# EAGLE design Lazerade_RGB (EAGLE 8.4.3)
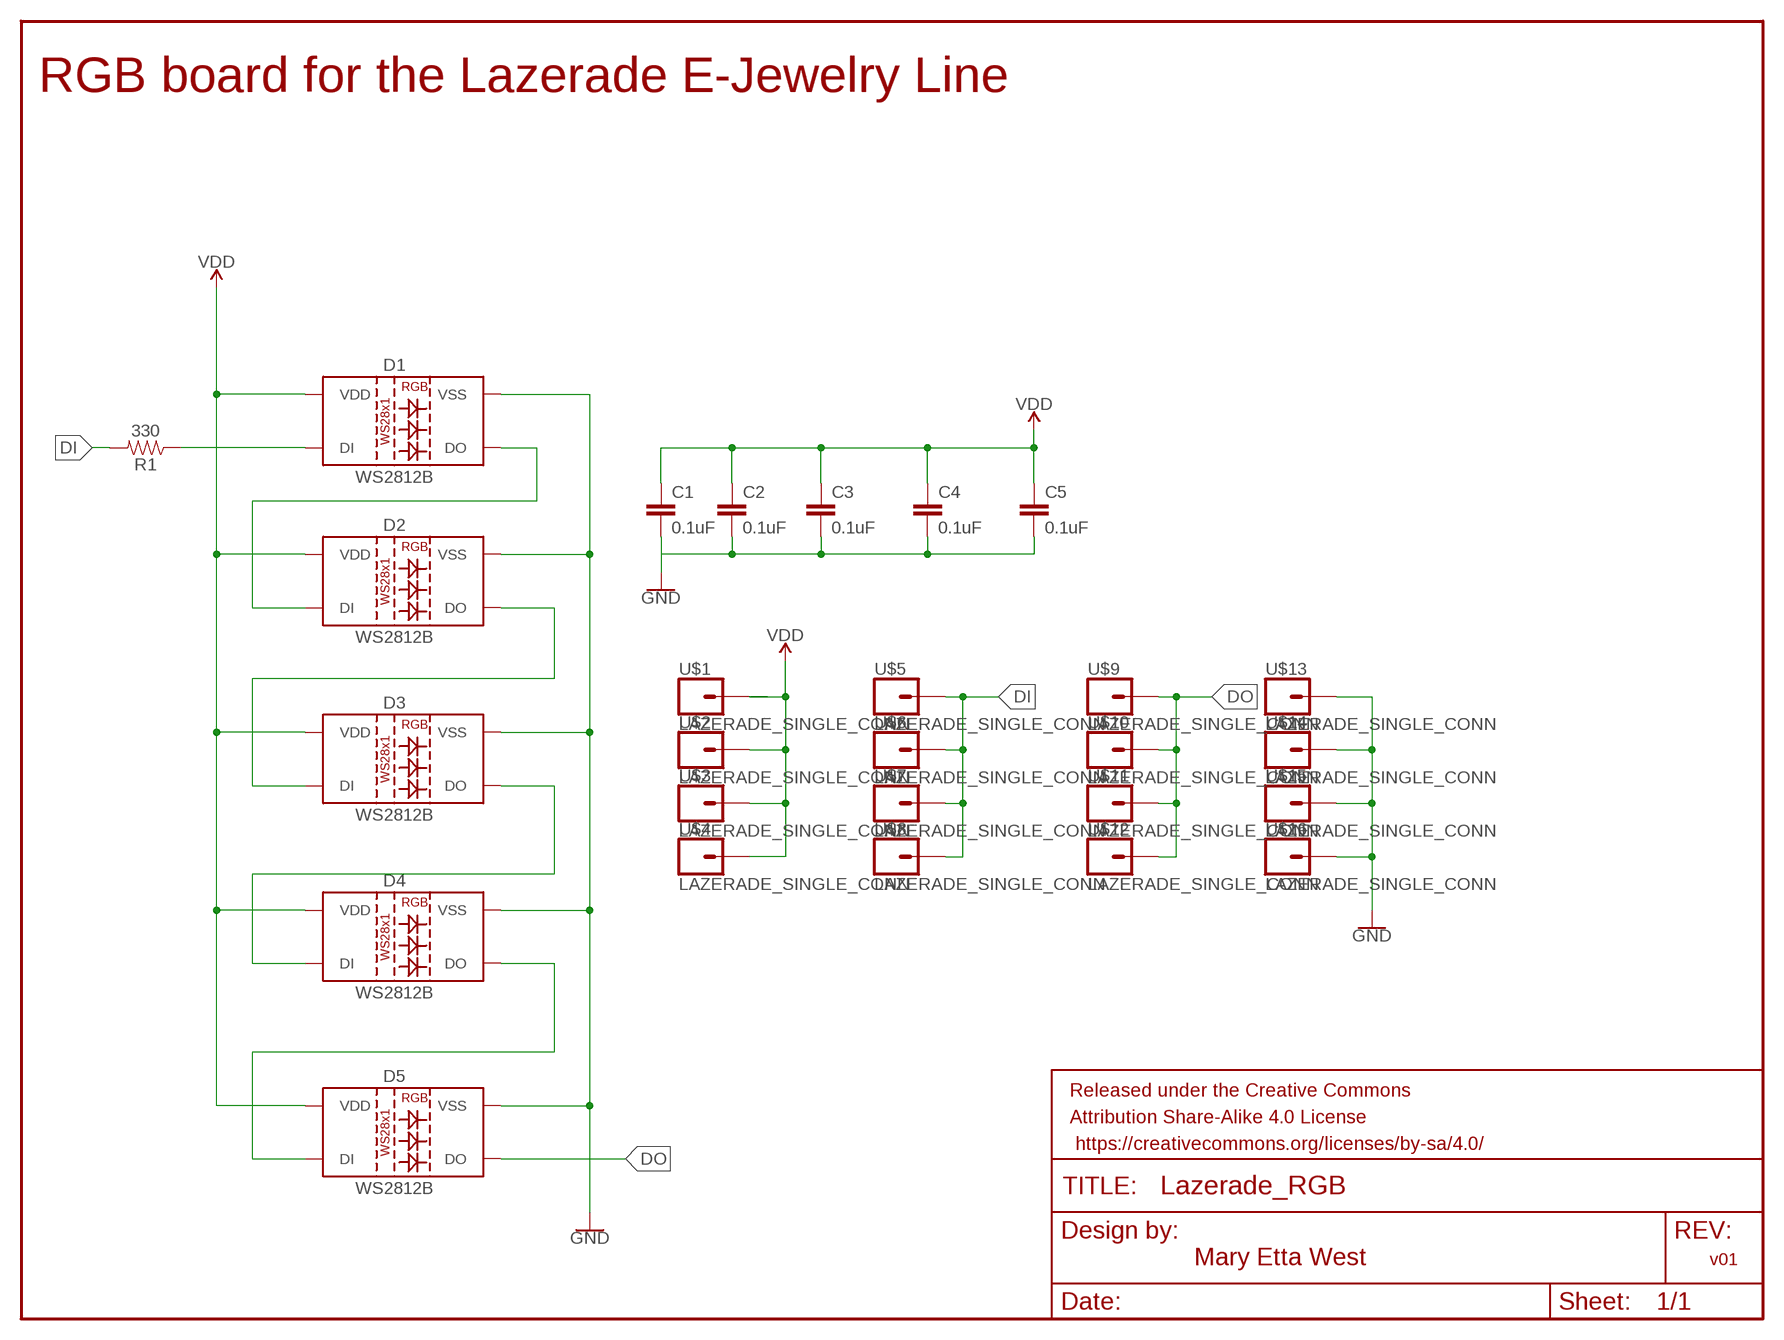
[diagram p0: schematic, sheet 1]

## Parts
C1  0.1uF  0.1UF-0603-25V-(+80/-20%)  [0603]
C2  0.1uF  0.1UF-0603-25V-(+80/-20%)  [0603]
C3  0.1uF  0.1UF-0603-25V-(+80/-20%)  [0603]
C4  0.1uF  0.1UF-0603-25V-(+80/-20%)  [0603]
C5  0.1uF  0.1UF-0603-25V-(+80/-20%)  [0603]
D1  WS2812B  [WS2812B]
D2  WS2812B  [WS2812B]
D3  WS2812B  [WS2812B]
D4  WS2812B  [WS2812B]
D5  WS2812B  [WS2812B]
FRAME1  FRAME-LETTER  [CREATIVE_COMMONS]
R1  330  330OHM-0603-1/10W-1%  [0603]
U$1  LAZERADE_SINGLE_CONN  [SINLGE_PAD_CONNECT]
U$2  LAZERADE_SINGLE_CONN  [SINLGE_PAD_CONNECT]
U$3  LAZERADE_SINGLE_CONN  [SINLGE_PAD_CONNECT]
U$4  LAZERADE_SINGLE_CONN  [SINLGE_PAD_CONNECT]
U$5  LAZERADE_SINGLE_CONN  [SINLGE_PAD_CONNECT]
U$6  LAZERADE_SINGLE_CONN  [SINLGE_PAD_CONNECT]
U$7  LAZERADE_SINGLE_CONN  [SINLGE_PAD_CONNECT]
U$8  LAZERADE_SINGLE_CONN  [SINLGE_PAD_CONNECT]
U$9  LAZERADE_SINGLE_CONN  [SINLGE_PAD_CONNECT]
U$10  LAZERADE_SINGLE_CONN  [SINLGE_PAD_CONNECT]
U$11  LAZERADE_SINGLE_CONN  [SINLGE_PAD_CONNECT]
U$12  LAZERADE_SINGLE_CONN  [SINLGE_PAD_CONNECT]
U$13  LAZERADE_SINGLE_CONN  [SINLGE_PAD_CONNECT]
U$14  LAZERADE_SINGLE_CONN  [SINLGE_PAD_CONNECT]
U$15  LAZERADE_SINGLE_CONN  [SINLGE_PAD_CONNECT]
U$16  LAZERADE_SINGLE_CONN  [SINLGE_PAD_CONNECT]

## Nets
DI: R1.2 U$5.P$1 U$6.P$1 U$7.P$1 U$8.P$1
DI_U: D1.4(DI) R1.1
DO: D5.2(DO) U$9.P$1 U$10.P$1 U$11.P$1 U$12.P$1
GND: C1.2 C2.2 C3.2 C4.2 C5.2 D1.3(VSS) D2.3(VSS) D3.3(VSS) D4.3(VSS) D5.3(VSS) U$13.P$1 U$14.P$1 U$15.P$1 U$16.P$1
N$3: D1.2(DO) D2.4(DI)
N$4: D2.2(DO) D3.4(DI)
N$5: D3.2(DO) D4.4(DI)
N$6: D4.2(DO) D5.4(DI)
VDD: C1.1 C2.1 C3.1 C4.1 C5.1 D1.1(VDD) D2.1(VDD) D3.1(VDD) D4.1(VDD) D5.1(VDD) U$1.P$1 U$2.P$1 U$3.P$1 U$4.P$1

## Notes on the sheet
- RGB board for the Lazerade E-Jewelry Line
- Mary Etta West | v01

## Library data of the parts
C1-C5 = SparkFun-Capacitors:0.1UF: 0.1µF ceramic capacitors A capacitor is a passive two-terminal electrical component used to store electrical energy temporarily in an electric field.; PROD_ID: CAP-00810
D1-D5 = SparkFun-LED:WS2812B: WS2812B SMD addressable RGB LED 5x5mm SMD LED with built-in controller IC. Color: Red/Green/Blue mC Rating: RGB: 390, 660, 180 mcd Forward Voltage: RGB: 2.0, 3.0, 3.0 V Packages:WS2812B SparkFun Products: Blynk Board - ESP8266 <https://www.sparkfun.com/products/13794>; PROD_ID: DIO-12503
FRAME1 = SparkFun-Aesthetics:FRAME-LETTER: Schematic Frame - Letter Standard 8.5x11 US Letter frame
R1 = SparkFun-Resistors:330OHM: 330Ω resistor A resistor is a passive two-terminal electrical component that implements electrical resistance as a circuit element. Resistors act to reduce current flow, and, at the same time, act to lower voltage levels within circuits. - Wikipedia; PROD_ID: RES-00818
U$1-U$16 = Lazerade_Connectors:LAZERADE_SINGLE_CONN

## Board
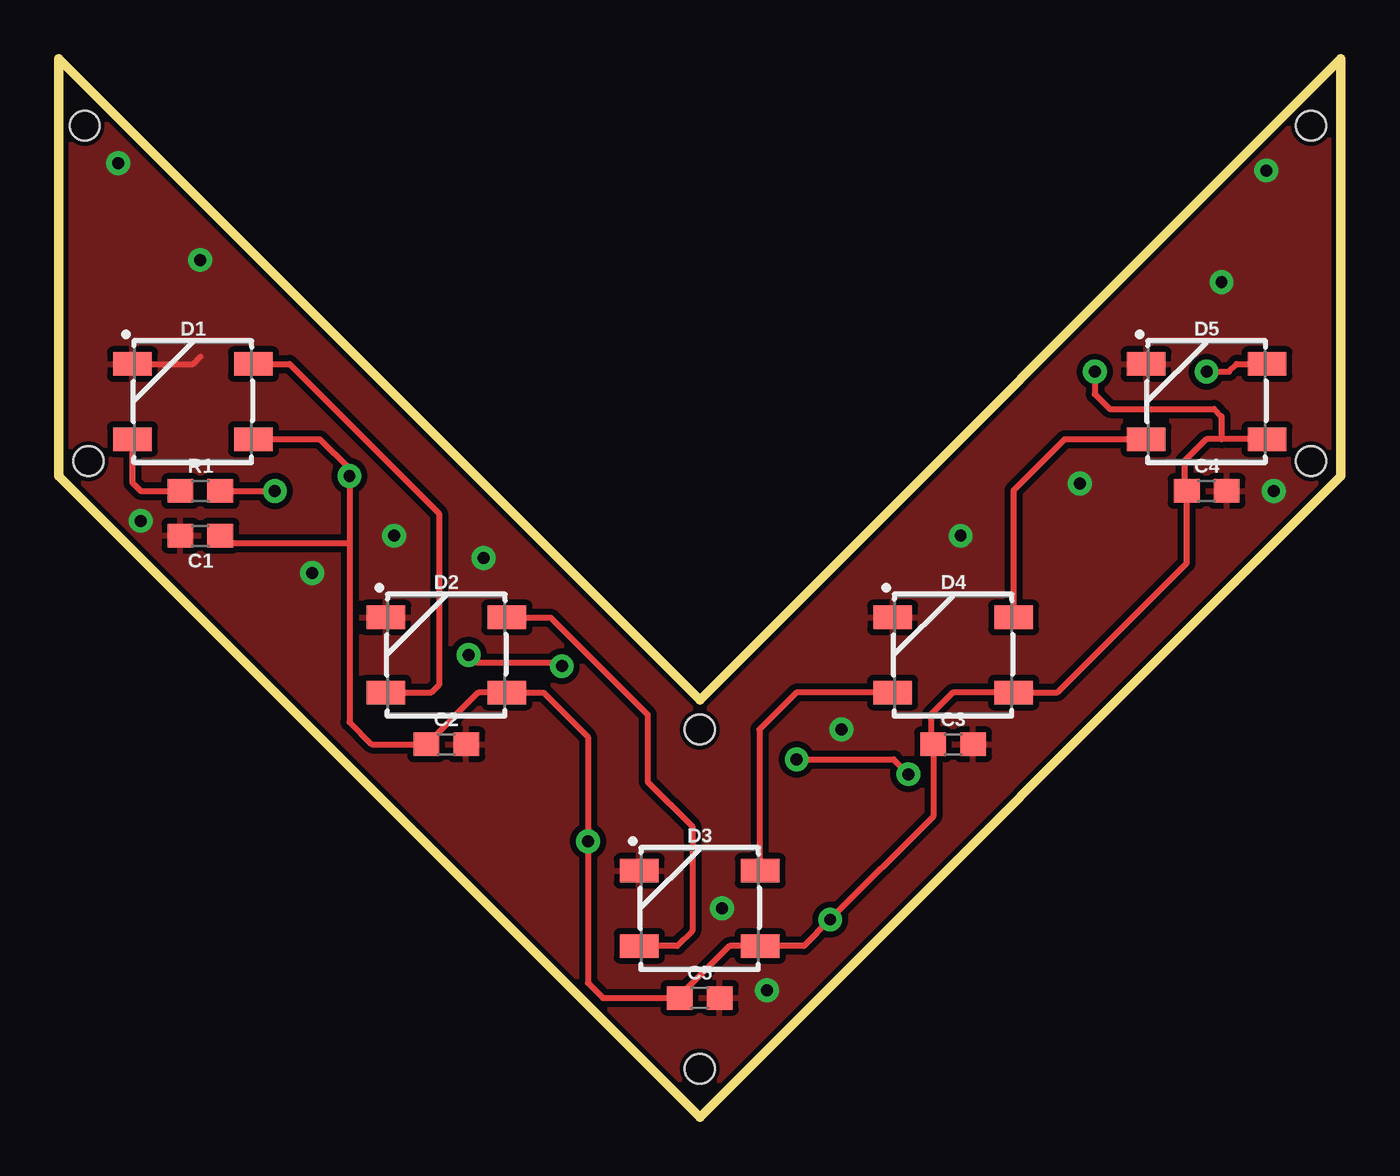
[diagram p1: board, top side]
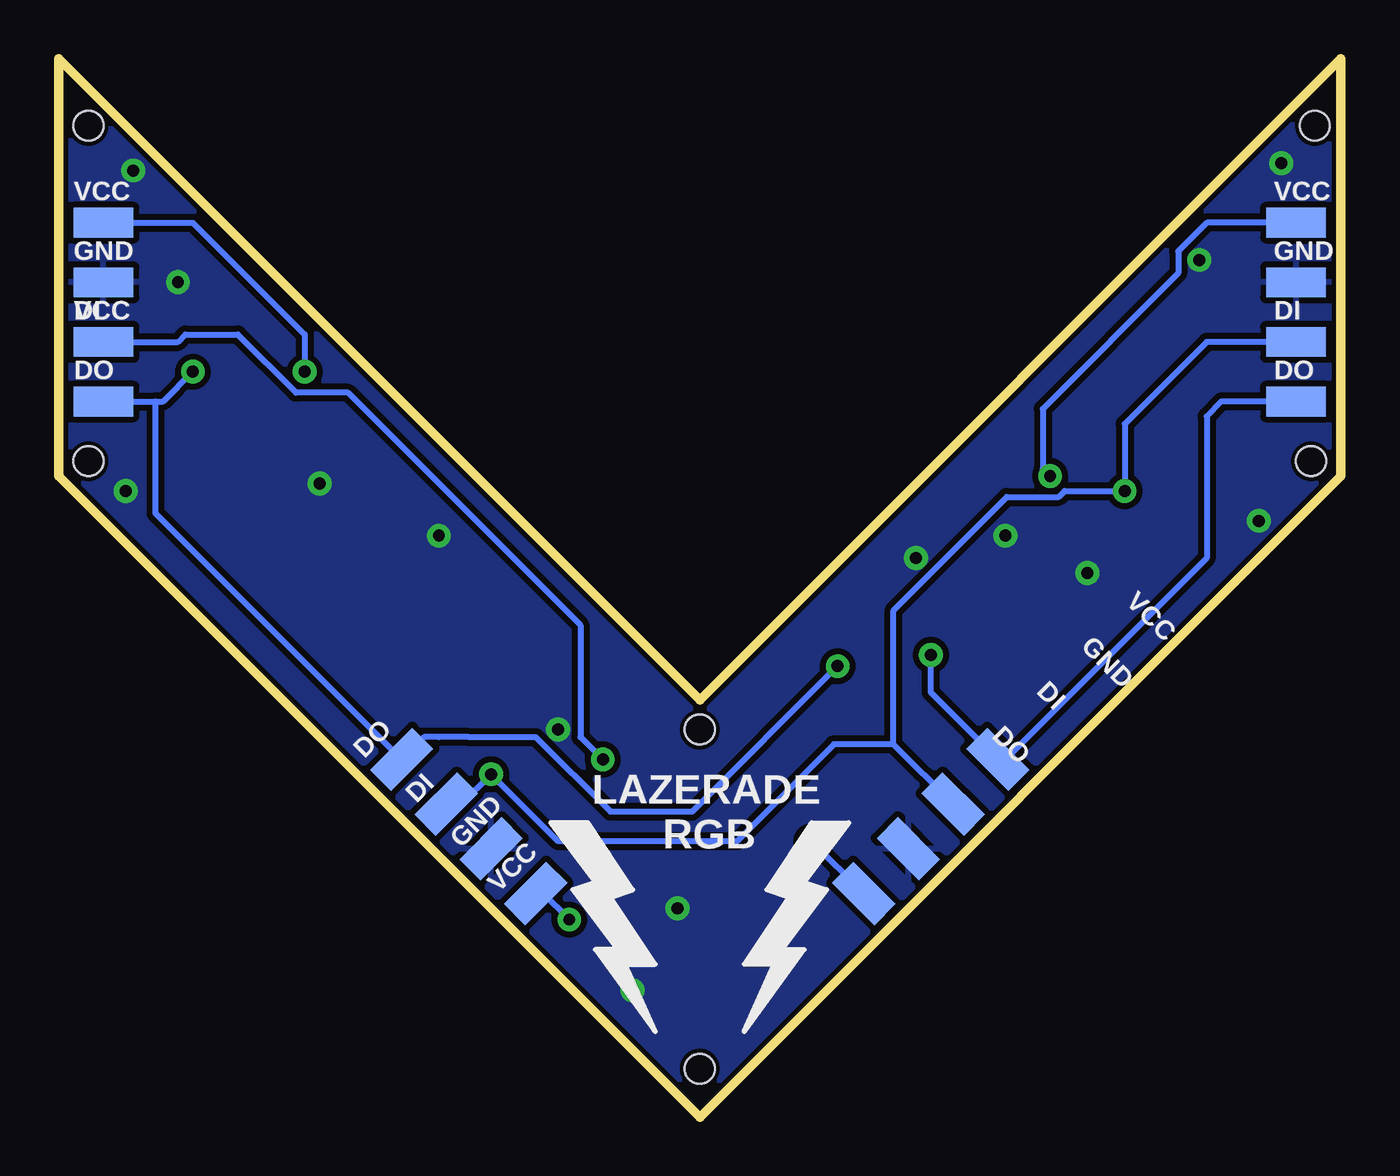
[diagram p2: board, bottom side, seen from below]

Size 54.61 x 45.09 mm. Coordinates in mm from the lower left corner, seen from the top.
Outline: 0,45.09 0,27.3 27.3,0 54.61,27.3 54.61,45.09 27.3,17.78 0,45.09
Copper layers (1*16): Top 0.035mm / dielectric 1.5mm / Bottom 0.035mm
Design rules "SparkFun-2-layer-STANDARD": minimum track width 10mil, minimum drill 20mil, track to track 10mil, track to pad 8mil, pad to pad 8mil, via to via 10mil, smd to smd 8mil, copper to edge 8mil, drill to drill 8mil, minimum pad ring 10mil, minimum via ring 10mil, stop-mask expansion 4mil, vias tented up to drill 25mil, thermal gap 10mil
Holes 1.27 mm at 1.11,42.23 1.27,27.94 53.34,27.94 53.34,42.23 27.3,2.06 27.3,16.51

### Footprints (pad centres in the part's own frame; a part is rotated, then mirrored left to right if it is on the bottom)
0603 = smd 1.1 x 1: 1 -0.85,0; 2 0.85,0
WS2812B = smd 1.651 x 1: 1 2.577,-1.6; 2 2.577,1.6; 3 -2.577,1.6; 4 -2.577,-1.6
SINLGE_PAD_CONNECT = smd 2.54 x 1.27: P$1 0,0

### Placement (x,y rotation side)
C1  6.03,24.77 180 top
C2  16.51,15.88 0 top
C3  38.1,15.88 0 top
C4  48.9,26.67 0 top
C5  27.3,5.08 0 top
D1  5.71,30.48 0 top
D2  16.51,19.68 0 top
D3  27.3,8.89 0 top
D4  38.1,19.68 0 top
D5  48.9,30.48 0 top
FRAME1  -3.17,-17.46 0 top  (outside the outline)
R1  6.03,26.67 0 top
U$1  52.7,38.1 0 bottom
U$2  20.32,9.53 315 bottom
U$3  34.29,9.53 45 bottom
U$4  1.91,38.1 0 bottom
U$5  1.91,33.02 0 bottom
U$6  52.7,33.02 0 bottom
U$7  38.1,13.34 45 bottom
U$8  16.51,13.34 315 bottom
U$9  1.91,30.48 0 bottom
U$10  14.6,15.24 315 bottom
U$11  40.01,15.24 45 bottom
U$12  52.7,30.48 0 bottom
U$13  52.7,35.56 0 bottom
U$14  1.91,35.56 0 bottom
U$15  36.2,11.43 45 bottom
U$16  18.42,11.43 315 bottom

### Tracks (layer width: path | path; a pad name or v marks a point on that pad's centre or on a via)
DI  (via drill 0.51)
  Top 0.254: R1.2 v9.21,26.67 | v31.43,15.24 35.56,15.24 v36.2,14.61
  Bottom 0.254: U$5.P$1 5.71,33.02 9.21,29.53 v9.21,26.67 11.76,26.67 12.01,26.42 14.22,26.42 19.05,21.59 19.05,15.88 | U$6.P$1 49.53,33.02 49.21,33.34 46.98,33.34 44.5,30.86 42.29,30.86 32.38,20.95 32.38,16.19 v31.43,15.24 | U$8.P$1 19.05,15.88 | U$7.P$1 37.47,13.34 v36.2,14.61 33.34,11.75 25.72,11.75 21.59,15.88 19.05,15.88
DI_U
  Top 0.254: D1.4 3.14,27.02 3.49,26.67 R1.1
DO  (via drill 0.51)
  Top 0.254: v48.9,31.75 49.85,31.75 50.18,32.08 D5.2 | v17.46,19.68 17.78,19.37 21.27,19.37 v21.43,19.21
  Bottom 0.254: U$9.P$1 5.08,30.48 5.71,29.84 5.71,23.81 14.29,15.24 U$10.P$1 17.46,18.1 v17.46,19.68 | U$12.P$1 50.48,30.48 | 50.48,30.48 50.16,30.48 v48.9,31.75 | 50.48,30.48 50.48,25.72 U$11.P$1 39.05,16.19 38.42,16.19 37.15,16.19 34.29,16.19 31.12,13.02 27.62,13.02 v21.43,19.21 21.27,19.37
GND  (via drill 0.51)
  Top 0.254: D1.3 5.73,32.08 6.03,32.38
  other vias: 6.03,36.51 10.79,23.18 14.29,24.77 18.1,23.81 38.42,24.77 43.5,26.99 2.54,40.64 3.49,25.4 28.26,8.89 33.34,16.51 51.75,26.67 51.44,40.32 49.53,35.56 30.16,5.4
  pour Top: 0,45.09 0,27.3 27.3,0 54.61,27.3 54.61,45.09 27.3,17.78
  pour Bottom: 0,45.09 0,27.3 27.3,0 54.61,27.3 54.61,45.09 27.3,17.78
N$3
  Top 0.254: D1.2 9.83,32.08 16.19,25.72 16.19,18.41 15.88,18.1 13.94,18.1 D2.4
N$4
  Top 0.254: D2.2 19.1,21.27 20.96,21.27 25.08,17.14 25.08,14.29 26.99,12.38 26.99,7.94 26.34,7.29 D3.4
N$5
  Top 0.254: D4.4 31.42,18.09 29.85,16.51 29.85,10.53 D3.2
N$6
  Top 0.254: D4.2 40.68,26.71 42.85,28.88 D5.4
VDD  (via drill 0.51)
  Top 0.254: D1.1 11.12,28.88 12.38,27.62 v12.38,27.3 12.38,24.45 | 12.38,24.45 12.38,16.83 13.33,15.88 C2.1 17.87,18.09 D2.1 20.65,18.09 22.54,16.19 v22.54,11.75 22.54,5.71 23.18,5.08 26.35,5.08 | C1.1 7.2,24.45 12.38,24.45 | 26.35,5.08 C5.1 | 26.35,5.08 28.56,7.29 D3.1 31.74,7.29 v32.86,8.41 37.25,12.8 C3.1 37.15,15.98 37.15,17.14 38.09,18.09 D4.1 40.69,18.1 42.55,18.1 48.05,23.6 C4.1 47.94,26.77 47.94,27.94 48.88,28.88 49.53,28.88 | D5.1 49.53,28.88 | v44.13,31.75 44.13,30.8 44.77,30.16 49.21,30.16 49.53,29.84 49.53,28.88
  Bottom 0.254: 12.38,27.62 v12.38,27.3 12.7,27.62 12.7,30.16 6.92,35.94 6.92,36.88 5.7,38.1 U$4.P$1 | U$2.P$1 v22.54,11.75 | U$3.P$1 33.97,9.53 v32.86,8.41 32.7,8.25 | U$1.P$1 48.9,38.1 44.13,33.34 v44.13,31.75

### Text on the board
bPlace: VCC | VCC | GND | GND | DI | DI | VCC | DO | DO | VCC | GND | DI | DO | DO | LAZERADE | DI | RGB | GND | VCC